# Altium schematic sheet EducationalBoardV2F103RBT6.SchDoc
size C
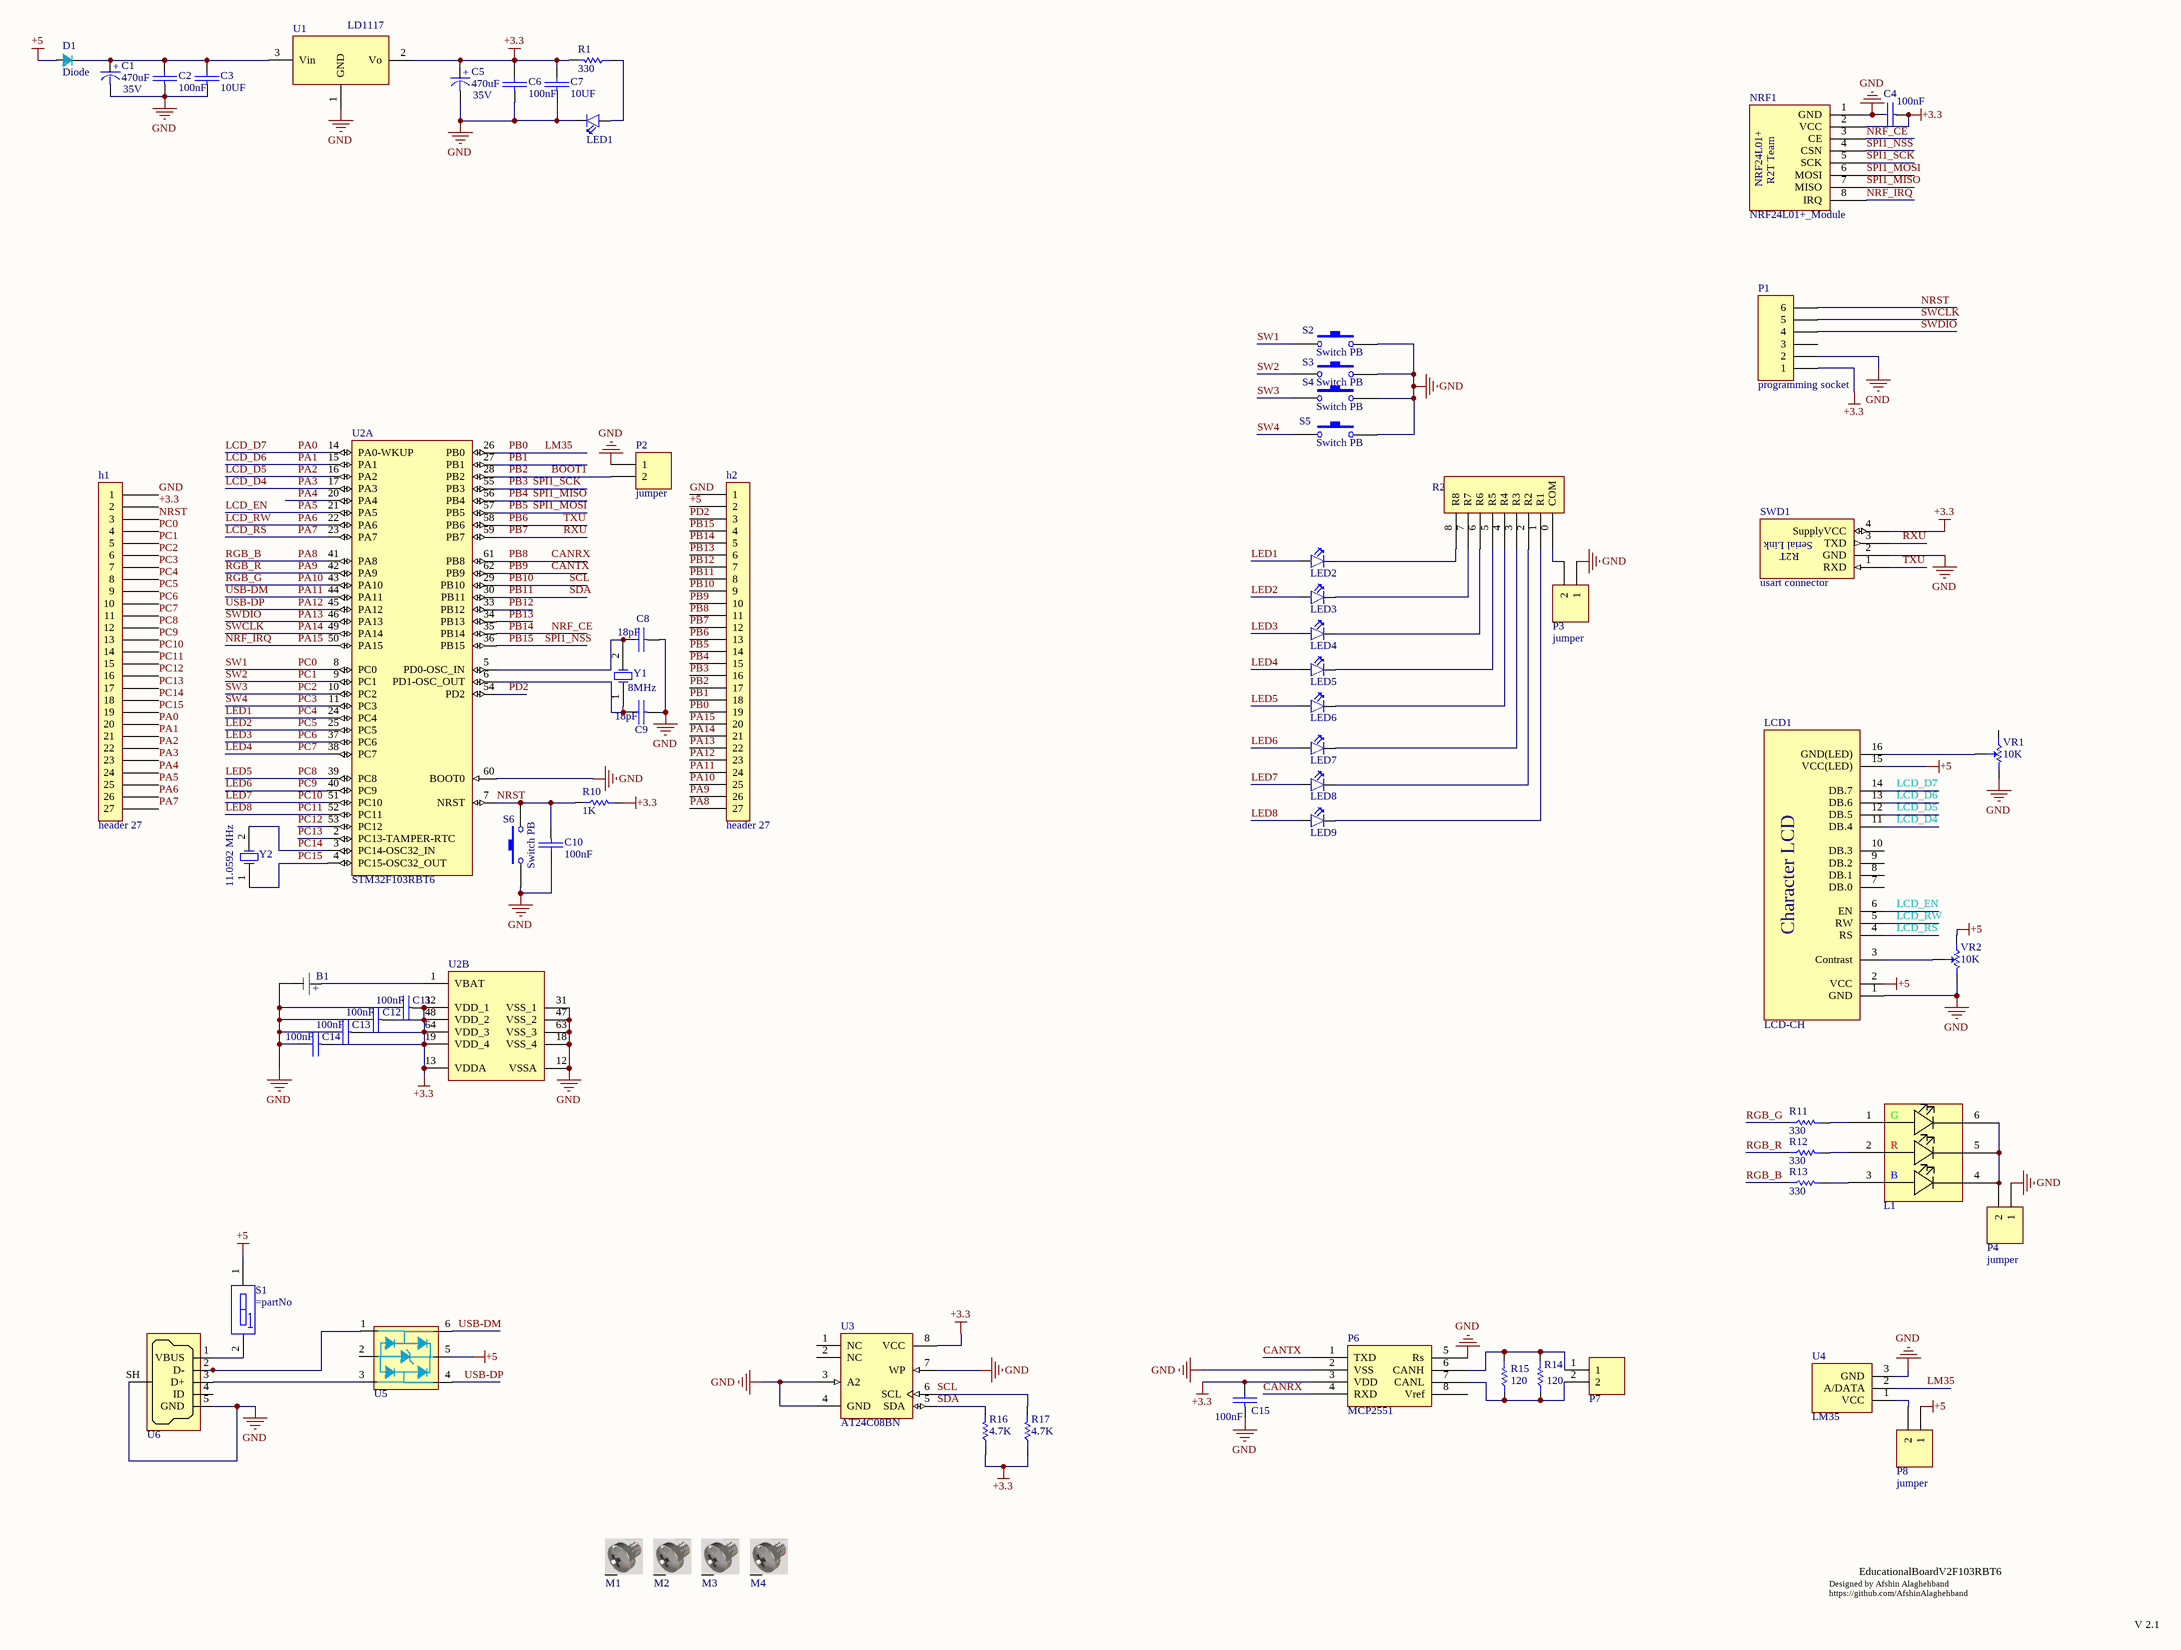
[diagram p0: EducationalBoardV2F103RBT6.SchDoc]

## Parts
B1  BatteryHolder  [Battery Holder CR1220-SMD]  (value not drawn)
C1  Voltage: 35V  [cap 03]  (hidden comment: 470uF)
C2  100nF  [SMD_CAP_0805]
C3  10UF  [SMD_CAP_0805]
C4  100nF  [SMD_CAP_0805]
C5  Voltage: 35V  [cap 03]  (hidden comment: 470uF)
C6  100nF  [SMD_CAP_0805]
C7  10UF  [SMD_CAP_0805]
C8  18pF  [SMD_CAP_1206]
C9  18pF  [SMD_CAP_1206]
C10  100nF  [SMD_CAP_0805]
C11  100nF  [SMD_CAP_0805]
C12  100nF  [SMD_CAP_0805]
C13  100nF  [SMD_CAP_0805]
C14  100nF  [SMD_CAP_0805]
C15  100nF  [SMD_CAP_0805]
D1  Description:: Diode  [DO-214AC ( SMD Diode )]  (hidden comment: Diodes)
h1  header 27  [PCBComponent_1]
h2  header 27  [PCBComponent_1]
L1  LED RGB  [LED_5050]  (value not drawn)
LCD1  LCD-CH  [LCD2-16]
LED1  LED  [LED0805]  (value not drawn)
LED2  LED  [LED0805]  (value not drawn)
LED3  LED  [LED0805]  (value not drawn)
LED4  LED  [LED0805]  (value not drawn)
LED5  LED  [LED0805]  (value not drawn)
LED6  LED  [LED0805]  (value not drawn)
LED7  LED  [LED0805]  (value not drawn)
LED8  LED  [LED0805]  (value not drawn)
LED9  LED  [LED0805]  (value not drawn)
M1  Screw  [Board Screw_No Silk]  (value not drawn)
M2  Screw  [Board Screw_No Silk]  (value not drawn)
M3  Screw  [Board Screw_No Silk]  (value not drawn)
M4  Screw  [Board Screw_No Silk]  (value not drawn)
NRF1  NRF24L01+_Module  [NRF24L01+_Module]
P1  programming socket  [HDR1X6]
P2  jumper  [HDR1X2]
P3  jumper  [HDR1X2]
P4  jumper  [HDR1X2]
P6  MCP2551  [MCP2551]
P7  can Connector  [PH Connector 2Pin]  (value not drawn)
P8  jumper  [HDR1X2]
R1  330  [RES 0805 (2012X06L)]
R2  ArrayResistor9pin  [ArrayRes9]  (value not drawn)
R10  1K  [RES 0805 (2012X06L)]
R11  330  [RES 0805 (2012X06L)]
R12  330  [RES 0805 (2012X06L)]
R13  330  [RES 0805 (2012X06L)]
R14  120  [RES 0805 (2012X06L)]
R15  120  [RES 0805 (2012X06L)]
R16  4.7K  [RES 0805 (2012X06L)]
R17  4.7K  [RES 0805 (2012X06L)]
S1  (no value)  [418117170901]
S2  Switch PB  [SW-PB]
S3  Switch PB  [SW-PB]
S4  Switch PB  [SW-PB]
S5  Switch PB  [SW-PB]
S6  Switch PB  [SW-PB]
SWD1  usart connector  [SerialWireMini]
U1  LD1117  [TO-252-reg]
U2  STM32F103RBT6  [STM-LQFP64_N]  (parts A,B of 2)
U3  AT24C08BN  [8S1_N]
U4  LM35  [LM35]
U5  USBLC6-2  [USBLC6-2]  (value not drawn)
U6  USB OTG  [USB_Micro]  (value not drawn)
VR1  10K  [Pot 00]
VR2  10K  [Pot 00]
Y1  8MHz  [XTAL Small]
Y2  11.0592 MHz  [XTAL RTC]

## Nets
+3.3: C4.2(-) C5.1(+) C6.1(+) C7.1(+) C11.2(-) C12.2(-) C13.2(-) C14.2(-) C15.1(+) h1.2 NRF1.2(VCC) P1.1 P6.3(VDD) R1.2 R10.2 R16.1 R17.1 SWD1.4(SupplyVCC) U1.2(Vo) U2.13(VDDA) U2.19(VDD_4) U2.32(VDD_1) U2.48(VDD_2) U2.64(VDD_3) U3.8(VCC)
+5: D1.0 h2.2 LCD1.2(VCC) LCD1.15(VCC(LED)) P8.1 S1.1 U5.5 VR2.1(CCW)
GND: B1.2 C1.2(-) C2.2(-) C3.2(-) C4.1(+) C5.2(-) C6.2(-) C7.2(-) C8.2(-) C9.2(-) C10.1(+) C11.1(+) C12.1(+) C13.1(+) C14.1(+) C15.2(-) h1.1 h2.1 LCD1.1(GND) LED1.2(K) NRF1.1(GND) P1.2 P2.1 P3.1 P4.1 P6.2(VSS) P6.5(Rs) S2.2 S3.2 S4.2 S5.2 S6.1 SWD1.2(GND) U1.1(GND) U2.12(VSSA) U2.18(VSS_4) U2.31(VSS_1) U2.47(VSS_2) U2.60(BOOT0) U2.63(VSS_3) U3.3(A2) U3.4(GND) U3.7(WP) U4.3(GND) U6.5(GND) U6.SH(Shell) VR1.2(CW) VR2.2(CW)
BOOT1: h2.17 P2.2 U2.28(PB2)  [also labelled PB2]
CANRX: h2.11 P6.4(RXD) U2.61(PB8)  [also labelled PB8]
CANTX: h2.10 P6.1(TXD) U2.62(PB9)  [also labelled PB9]
LCD_D4: h1.23 LCD1.11(DB.4) U2.17(PA3)  [also labelled PA3]
LCD_D5: h1.22 LCD1.12(DB.5) U2.16(PA2)  [also labelled PA2]
LCD_D6: h1.21 LCD1.13(DB.6) U2.15(PA1)  [also labelled PA1]
LCD_D7: h1.20 LCD1.14(DB.7) U2.14(PA0-WKUP)  [also labelled PA0]
LCD_EN: h1.25 LCD1.6(EN) U2.21(PA5)  [also labelled PA5]
LCD_RS: h1.27 LCD1.4(RS) U2.23(PA7)  [also labelled PA7]
LCD_RW: h1.26 LCD1.5(RW) U2.22(PA6)  [also labelled PA6]
LED1: h1.8 LED2.1(A) U2.24(PC4)  [also labelled PC4]
LED2: h1.9 LED3.1(A) U2.25(PC5)  [also labelled PC5]
LED3: h1.10 LED4.1(A) U2.37(PC6)  [also labelled PC6]
LED4: h1.11 LED5.1(A) U2.38(PC7)  [also labelled PC7]
LED5: h1.12 LED6.1(A) U2.39(PC8)  [also labelled PC8]
LED6: h1.13 LED7.1(A) U2.40(PC9)  [also labelled PC9]
LED7: h1.14 LED8.1(A) U2.51(PC10)  [also labelled PC10]
LED8: h1.15 LED9.1(A) U2.52(PC11)  [also labelled PC11]
LM35: h2.19 U2.26(PB0) U4.2(A/DATA)  [also labelled PB0]
NRF_CE: h2.5 NRF1.3(CE) U2.35(PB14)  [also labelled PB14]
NRF_IRQ: h2.20 NRF1.8(IRQ) U2.50(PA15)  [also labelled PA15]
NRST: C10.2(-) h1.3 P1.6 R10.1 S6.2 U2.7(NRST)
PA4: h1.24 U2.20(PA4)
PA8: h2.27 R13.1 U2.41(PA8)  [also labelled RGB_B]
PA9: h2.26 R12.1 U2.42(PA9)  [also labelled RGB_R]
PA10: h2.25 R11.1 U2.43(PA10)  [also labelled RGB_G]
PA11: h2.24 U2.44(PA11) U5.6(IO)  [also labelled USB-DM]
PA12: h2.23 U2.45(PA12) U5.4  [also labelled USB-DP]
PA13: h2.22 P1.4 U2.46(PA13)  [also labelled SWDIO]
PA14: h2.21 P1.5 U2.49(PA14)  [also labelled SWCLK]
PB1: h2.18 U2.27(PB1)
PB3: h2.16 NRF1.5(SCK) U2.55(PB3)  [also labelled SPI1_SCK]
PB4: h2.15 NRF1.7(MISO) U2.56(PB4)  [also labelled SPI1_MISO]
PB5: h2.14 NRF1.6(MOSI) U2.57(PB5)  [also labelled SPI1_MOSI]
PB6: h2.13 SWD1.1(RXD) U2.58(PB6)  [also labelled TXU]
PB7: h2.12 SWD1.3(TXD) U2.59(PB7)  [also labelled RXU]
PB10: h2.9 R17.2 U2.29(PB10) U3.6(SCL)  [also labelled SCL]
PB11: h2.8 R16.2 U2.30(PB11) U3.5(SDA)  [also labelled SDA]
PB12: h2.7 U2.33(PB12)
PB13: h2.6 U2.34(PB13)
PB15: h2.4 NRF1.4(CSN) U2.36(PB15)  [also labelled SPI1_NSS]
PC0: h1.4 S2.1 U2.8(PC0)  [also labelled SW1]
PC1: h1.5 S3.1 U2.9(PC1)  [also labelled SW2]
PC2: h1.6 S4.1 U2.10(PC2)  [also labelled SW3]
PC3: h1.7 S5.1 U2.11(PC3)  [also labelled SW4]
PC12: h1.16 U2.53(PC12)
PC13: h1.17 U2.2(PC13-TAMPER-RTC)
PC14: h1.18 U2.3(PC14-OSC32_IN) Y2.2(OSC2)
PC15: h1.19 U2.4(PC15-OSC32_OUT) Y2.1(OSC1)
PD2: h2.3 U2.54(PD2)
NetB1_1: B1.1 U2.1(VBAT)
NetC1_1: C1.1(+) C2.1(+) C3.1(+) D1.1 U1.3(Vin)
NetC8_1: C8.1(+) U2.5(PD0-OSC_IN) Y1.2(OSC2)
NetC9_1: C9.1(+) U2.6(PD1-OSC_OUT) Y1.1(OSC1)
NetL1_1: L1.1(G) R11.2
NetL1_2: L1.2(R) R12.2
NetL1_3: L1.3(B) R13.2
NetL1_4: L1.4 L1.5 L1.6 P4.2
NetLCD1_3: LCD1.3(Contrast) VR2.3(Setpoint)
NetLCD1_16: LCD1.16(GND(LED)) VR1.3(Setpoint)
NetLED1_1: LED1.1(A) R1.1
NetLED2_2: LED2.2(K) R2.8(R8)
NetLED3_2: LED3.2(K) R2.7(R7)
NetLED4_2: LED4.2(K) R2.6(R6)
NetLED5_2: LED5.2(K) R2.5(R5)
NetLED6_2: LED6.2(K) R2.4(R4)
NetLED7_2: LED7.2(K) R2.3(R3)
NetLED8_2: LED8.2(K) R2.2(R2)
NetLED9_2: LED9.2(K) R2.1(R1)
NetP3_2: P3.2 R2.0(COM)
NetP6_6: P6.6(CANH) P7.1 R14.2 R15.2
NetP6_7: P6.7(CANL) P7.2 R14.1 R15.1
NetP8_2: P8.2 U4.1(VCC)
NetS1_2: S1.2 U6.1(VBUS)
NetU5_1: U5.1 U6.2(D-)
NetU5_3: U5.3 U6.3(D+)

Not connected (* = marked no-connect by the designer): LCD1 7(DB.0) 8(DB.1) 9(DB.2) 10(DB.3); M1 S; M2 S; M3 S; M4 S; P1 3; P6 8(Vref); U3 1(NC) 2(NC); U5 2(0); U6 4(ID); VR1 1(CCW)

## Notes on the sheet
- Designed by Afshin Alaghehband https://github.com/AfshinAlaghehband
- EducationalBoardV2F103RBT6
- V 2.1
- (in symbol BatteryHolder) +
- (in symbol LCD-CH) Character LCD
- (in symbol NRF24L01+_Module) NRF24L01+; R2T Team
- (in symbol R2T-MiniSerial) Serial Link; R2T

## Library data of the parts
C1 C5 = Cap-Polar: Polar Capacitor; Designer: Saeid Jorablo; Organazation: ControTec; Adding Date: 1387/12/20; Value: 470uF
C2-C4 C6-C15 = Cap-Bipolar: Bipolar Capacitor; Voltage: 100V; Designer: Saeid Jorablo; Organazation: ControTec; Adding Date: 1387/12/20
  C2 C4 C6 C10-C15: Value: 100nF
  C3 C7: Value: 10UF
  C8 C9: Value: 18pF
D1 = Diodes: Designer :: Hamed Jafarzadeh
L1 = LED RGB: LED 5050 RGB
LED1 = LED: Designer :: Razi Research Team Of Mashhad - Hamed Jafarzadeh
LED2-LED9 = LED: LED Red; Designer :: Razi Research Team Of Mashhad - Hamed Jafarzadeh
M1-M4 = Board Screw: Board Screw With Spacer
NRF1 = NRF24L01+_Module: Designer:: HamedJafarzadeh
P1 = Header 6: Header, 6-Pin; LatestRevisionDate: 17-Jul-2002; LatestRevisionNote: Re-released for DXP Platform.; Publisher: Altium Limited
P2-P4 P8 = Header 2: Header, 2-Pin; LatestRevisionDate: 17-Jul-2002; LatestRevisionNote: Re-released for DXP Platform.; Publisher: Altium Limited
P6 = MCP2551: CAN TRANSCEIVERS
P7 = Connector 2Pin: Designer:: Hamed Jafarzadeh - www.R2T.ir
R1 R10-R13 R15-R17 = Resistor: Tolerance: 5%; Power: 1/8 W
  R1 R11-R13: Value: 330
  R10: Value: 1K
  R15: Value: 120
  R16 R17: Value: 4.7K
R14 = Resistor: Value: 120
S1 = DipSwitch1: WS-DITV 2.54 mm compact THT with flat actuator; Manufacturer: Wurth Elektronik; ComponentLink1 Description: Manufacturer; ComponentLink2 Description: Datasheet; Pole: 01; Created Date: Dec.2015; Part No.: 418117170901; ComponentLink1URL: http://www.we-online.com; ComponentLink2URL: http://katalog.we-online.de/em/datasheet/4181171709xx.pdf; Created by: Baojun Chen
S2-S6 = Switch PB: Push Button Switch
SWD1 = R2T-MiniSerial
U2 = STM32F103RBT6: ARM Cortex-M3 32-bit MCU; A/D Converter: 2x12-bit (16 Channel); FLASH Size (Prog) (kB): 128; I/Os (High Current): 51; Internal RAM Size (kB): 20; Operating Frequency(F) (Processor speed) (MHz): 72; Packing: Tray; Supply Voltage(Vcc) min (V): 2; DatasheetVersion: Rev. 16; PackageVersion: Rev. 4, 06/2013; PackageReference: LQFP64; PackageDescription: 64-Pin Low Profile Quad Flat Package, 10 x 10 mm Body, 0.5 mm Pitch; Supplier 1: Digi-Key; Supplier Part Number 1: 497-6066-ND; Supplier 2: Farnell; Supplier Part Number 2: 1447640; Supplier 3: Newark; Supplier Part Number 3: 59M2183; Supplier 4: Newark; Supplier Part Number 4: 57P1224; Supplier 5: Mouser; Supplier Part Number 5: 511-STM32F103RBT6; Core: ARM Cortex-M3; Mounting Technology: Surface Mount; PartNumber: STM32F103RBT6; ComponentLink1Description: Manufacturer URL; ComponentLink1URL: http://www.st.com/web/en/home.html; ComponentLink2Description: Datasheet; ComponentLink2URL: http://www.st.com/st-web-ui/static/active/en/resource/technical/document/datasheet/CD00161566.pdf; ComponentLink3Description: Package Specification; ComponentLink3URL: http://www.st.com/st-web-ui/static/active/en/resource/technical/document/datasheet/DM00037051.pdf
U3 = AT24C08BN-SP25-B: Serial EEPROM; DatasheetVersion: 8517C,  Jan-2009; PackageVersion: revC, Mar-2005; PackageReference: 8S1; PackageDescription: 8-Lead (0.150" Wide Body), Plastic Gull Wing Small Outline (JEDEC SOIC); Code_JEDEC: MS-012-AA; Code_IPC: SOIC127P600-8; ComponentLink1Description: Manufacturer URL; ComponentLink1URL: http://www.atmel.com/; ComponentLink2Description: Datasheet; ComponentLink2URL: http://www.atmel.com/dyn/resources/prod_documents/doc8517.pdf
U5 = USBLC6-2: Very low capacitance ESD protection;; Designer: Hamed Jafarzadeh
U6 = USB OTG: Designer:: Hamed Jafarzadeh
VR1 VR2 = Resistor Variable: Variable Resistor; Designer: Saeid Jorablo; Company: ControTec; Adding Date: 137/12/22; Value: 10K
Y1 Y2 = XTAL: XTAL Crystal; Company: E.P.I.L; Design Date: 11/04/2011
  Y1: Value: 8MHz
  Y2: Value: 11.0592 MHz